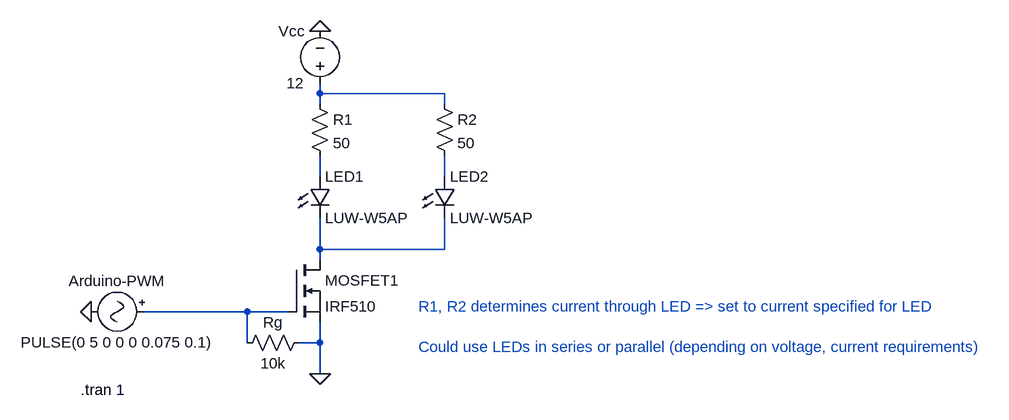
[diagram p0: schematic LED dimmer using MOSFET PWM.asc]
LED dimmer using MOSFET PWM.asc, the LTspice schematic file:
Version 4
SHEET 1 1616 680
WIRE 224 -144 224 -160
WIRE 416 -144 224 -144
WIRE 224 -128 224 -144
WIRE 416 -128 416 -144
WIRE 224 -16 224 -48
WIRE 416 -16 416 -48
WIRE 224 96 224 48
WIRE 416 96 416 48
WIRE 416 96 224 96
WIRE 224 112 224 96
WIRE 112 192 -48 192
WIRE 176 192 112 192
WIRE 112 240 112 192
WIRE 224 240 224 208
WIRE 224 240 192 240
WIRE 224 288 224 240
FLAG 224 288 0
FLAG 224 -240 0
FLAG -128 192 0
SYMBOL nmos 176 112 R0
SYMATTR InstName MOSFET1
SYMATTR Value IRF510
SYMBOL voltage 224 -144 R180
WINDOW 0 24 96 Left 2
WINDOW 3 24 16 Left 2
SYMATTR InstName Vcc
SYMATTR Value 12
SYMBOL res 208 -144 R0
SYMATTR InstName R1
SYMATTR Value 50
SYMBOL Misc\\signal -32 192 R90
WINDOW 0 -32 56 VBottom 2
WINDOW 3 32 56 VTop 2
WINDOW 123 0 0 Left 0
WINDOW 39 0 0 Left 0
SYMATTR InstName Arduino-PWM
SYMATTR Value PULSE(0 5 0 0 0 0.075 0.1)
SYMBOL res 208 224 R90
WINDOW 0 0 56 VBottom 2
WINDOW 3 32 56 VTop 2
SYMATTR InstName Rg
SYMATTR Value 10k
SYMBOL LED 208 -16 R0
SYMATTR InstName LED1
SYMATTR Value LUW-W5AP
SYMBOL res 400 -144 R0
SYMATTR InstName R2
SYMATTR Value 50
SYMBOL LED 400 -16 R0
SYMATTR InstName LED2
SYMATTR Value LUW-W5AP
TEXT -144 312 Left 2 !.tran 1
TEXT 376 184 Left 2 ;R1, R2 determines current through LED => set to current specified for LED\n \nCould use LEDs in series or parallel (depending on voltage, current requirements)

The netlist it stands for:
* LED dimmer using MOSFET PWM.asc
MOSFET1 N004 N005 0 0 IRF510
Vcc N001 0 12
R1 N001 N002 50
V§Arduino-PWM N005 0 PULSE(0 5 0 0 0 0.075 0.1)
Rg 0 N005 10k
D§LED1 N002 N004 LUW-W5AP
R2 N001 N003 50
D§LED2 N003 N004 LUW-W5AP
.model D D
.lib standard.dio
.model NMOS NMOS
.model PMOS PMOS
.lib standard.mos
.tran 1
* R1, R2 determines current through LED => set to current specified for LED
* Could use LEDs in series or parallel (depending on voltage, current requirements)
.backanno
.end